# Altium project UU005_UUTurbidity.PrjPcb
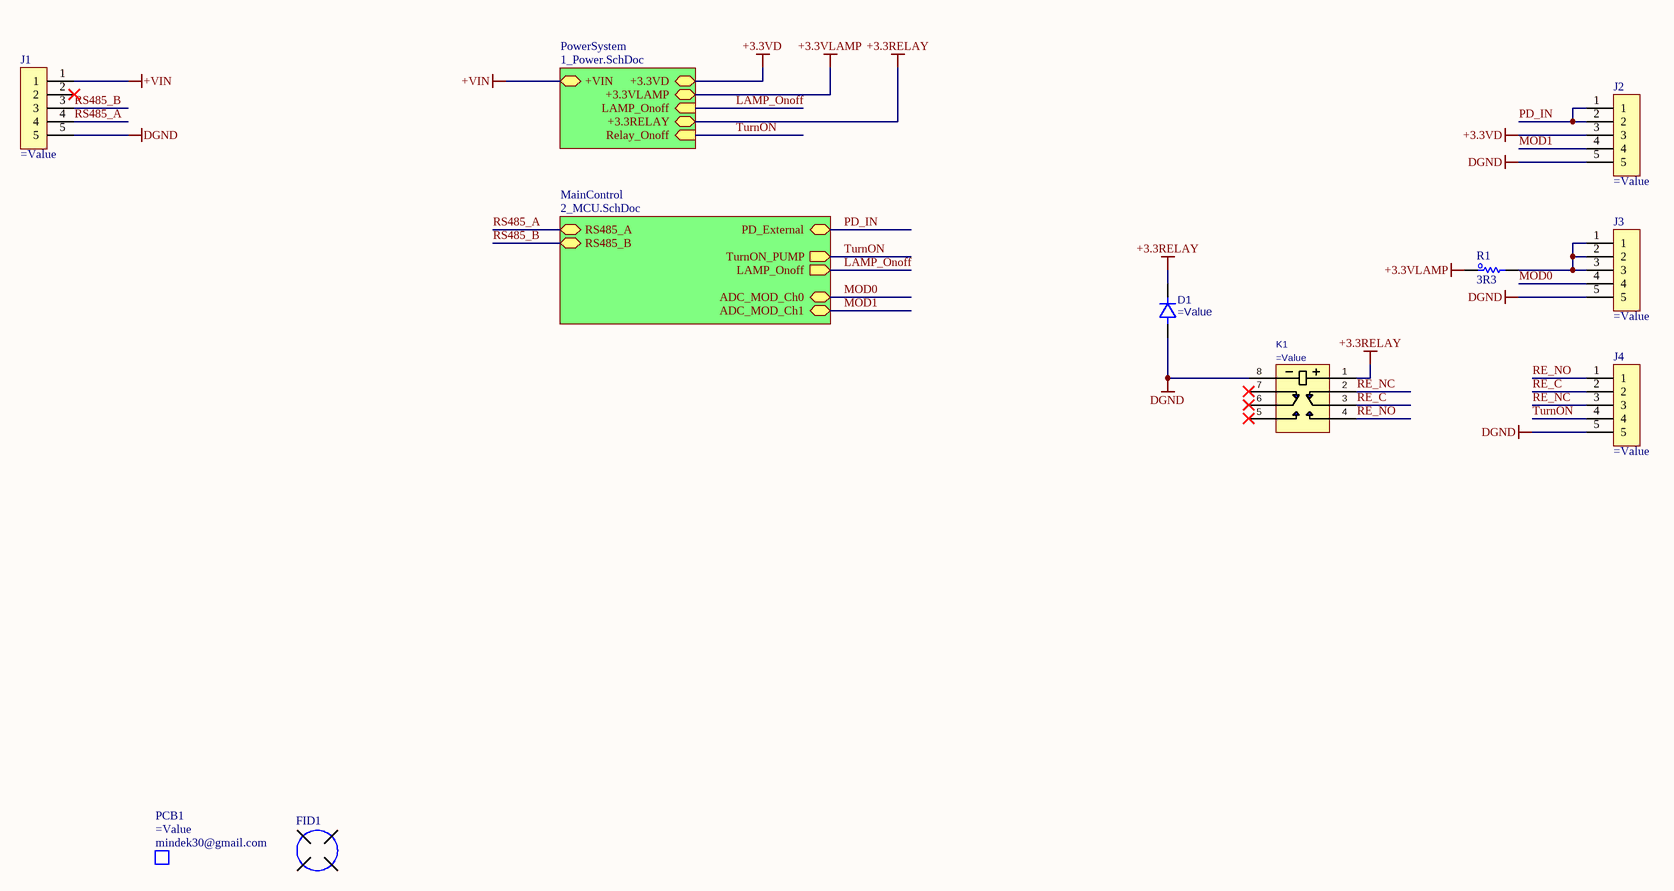
[diagram p0: 0_Overview.SchDoc]
PCB_Name: UU Turbidity; PCB_PN: UST001; PCB_Rev: A1; PCBA_PN: UST001; PCBA_Rev: A1
3 sheets, 70 parts. Net scope: hierarchical (ports join the sheet entries above them; power ports are global).
Board file: UST001_UUTurbidityControl.PcbDoc
Sheets:
  0_Overview.SchDoc
    MainControl = 2_MCU.SchDoc
    PowerSystem = 1_Power.SchDoc

## Sheet 0_Overview.SchDoc: Overview
size A3; DocumentNumber: 1; SheetNumber: 1; SheetTotal: 6; PageSetup: Record=PageOptions|CenterHorizontal=True|CenterVertical=True|PrintScale=1.01|XCorrection=1.00|YCorrection=1.00|PrintKind=0|BorderSize=5000000|LeftOffset=0|BottomOffset=0|Orientation=2|PaperLength=1000|PaperWidth=1000|Scale=100|PaperSource=7|PrintQuality=-4|MediaType=1|DitherType=10|PaperKind=A3|PrintScaleMode=1

### Parts
D1  (no value)  [SOD323]
FID1  FIDUCIAL  [FID]  (value not drawn)  (no BOM)
J1  (no value)  [MOLEX_532610571]
J2  (no value)  [MOLEX_532610571]
J3  (no value)  [MOLEX_532610571]
J4  (no value)  [MOLEX_532610571]
K1  (no value)  [RELAY_HFD4/12-SR]
PCB1  Manufacturer: mindek30@gmail.com  (mechanical)
R1  3R3  [R_2512]

### Sub-sheets
MainControl = 2_MCU.SchDoc: RS485_A (bidir), RS485_B (bidir), LAMP_Onoff (out), TurnON_PUMP (out), ADC_MOD_Ch0 (bidir), ADC_MOD_Ch1 (bidir), PD_External (bidir)
PowerSystem = 1_Power.SchDoc: +3.3VD (bidir), +VIN (bidir), +3.3VLAMP (bidir), LAMP_Onoff (in), Relay_Onoff (in), +3.3RELAY (bidir)

### Nets
+3.3RELAY: D1.1 K1.1 ; sheet PowerSystem/+3.3RELAY
+3.3VD: J2.3 ; sheet PowerSystem/+3.3VD
+3.3VLAMP: R1.1 ; sheet PowerSystem/+3.3VLAMP
+VIN: J1.1 ; sheet PowerSystem/+VIN
DGND: D1.2 J1.5 J2.5 J3.5 J4.5 K1.8
LAMP_Onoff: sheet MainControl/LAMP_Onoff, sheet PowerSystem/LAMP_Onoff
MOD0: J3.4 ; sheet MainControl/ADC_MOD_Ch0  [project net ADC_MOD_Ch0]
MOD1: J2.4 ; sheet MainControl/ADC_MOD_Ch1  [project net ADC_MOD_Ch1]
PD_IN: J2.1 J2.2 ; sheet MainControl/PD_External  [project net ADC_Ch0]
RE_C: J4.2 K1.3
RE_NC: J4.3 K1.2
RE_NO: J4.1 K1.4
RS485_A: J1.4 ; sheet MainControl/RS485_A
RS485_B: J1.3 ; sheet MainControl/RS485_B
TurnON: J4.4 ; sheet MainControl/TurnON_PUMP, sheet PowerSystem/Relay_Onoff
NetJ3_1: J3.1 J3.2 J3.3 R1.2

Not connected (* = marked no-connect by the designer): J1 2*; K1 5* 6* 7*

### Notes on the sheet
- Title :
- Revision :
- ผู้จัดทำ:
- Size:
- A3
- Time:
- ผู้เขียน:
- บริษัท ยูนิเวอร์แซล ยูทีลิตี้ส์ จำกัด (มหาชน) เลขที่ 1 อาคาร อีสท์วอเตอร์ ชั้น 18 ซอยวิภาวดีรังสิต 5 แขวงจอมพล เขตจตุจักร กรุงเทพฯ 10900
  Tel : +662-272-1688
  Fax :+662-2721690-1
- -
- Sheet:
- of
- ผู้อำนวยการ
- ผู้ตรวจสอบ:
- Number:
- กรรมการผู้จัดการ:
- File:

### Library data of the parts
D1 = D_PW_SD103AWS: DIODE SCHOTTKY 40V 2A 0603; Manufacturer: Slkor(SLKORMICRO Elec.); Value: SD103AWS; PackageReference: SOD-323; PartID: C513472; PartNumber: SD103AWS
FID1 = FID_FIDUCIAL: Manufacturer: mindek30@gmail.com; PartNumber: UST001_A1; Value2: Non SE; Value: Non SE; PartID: A1; PackageReference: Non SE; Value3: Non SE
J1-J4 = CON_5P_532610571: CONN HEADER SMD R/A 5POS 1.25MM; PartNumber: 0532610571; Manufacturer: Molex; Value: 0532610571; Value2: AFC12-S05DCC-00; PartID: WM7623CT-ND; PackageReference: 5P; Value3: *
K1 = SW_RELAY_HFD4/12-SR: Telecom Non Latching 3VDC DPDT SMD Relays RoHS; Manufacturer: Xiamen Hongfa Electroacoustic; Value: HFD4/3-S1R; PackageReference: *; PartID: C143232; PartNumber: HFD4/3-S1R
PCB1 = PCB_Bare: BARE PCB; PartNumber: UST001_A1; PackageReference: Non SE; PartID: A1; Value2: =JobFile_Title; Value: =PartNumber; Value3: UST001_A1
R1 = R_Resister: RES SMD 3.3 OHM 5% 3W 2512; Manufacturer: Vishay; PartNumber: 35223R3JT; Value: 3R3; PackageReference: 2512; PartID: A121247CT-ND; Value2: 3W; Value3: 5%

## Sheet 2_MCU.SchDoc
size A3; DocumentNumber: 3; SheetNumber: 3; SheetTotal: 6; PageSetup: Record=PageOptions|CenterHorizontal=True|CenterVertical=True|PrintScale=1.01|XCorrection=1.00|YCorrection=1.00|PrintKind=0|BorderSize=5000000|LeftOffset=0|BottomOffset=0|Orientation=2|PaperLength=1000|PaperWidth=1000|Scale=100|PaperSource=7|PrintQuality=-4|MediaType=1|DitherType=10|PaperKind=A3|PrintScaleMode=1
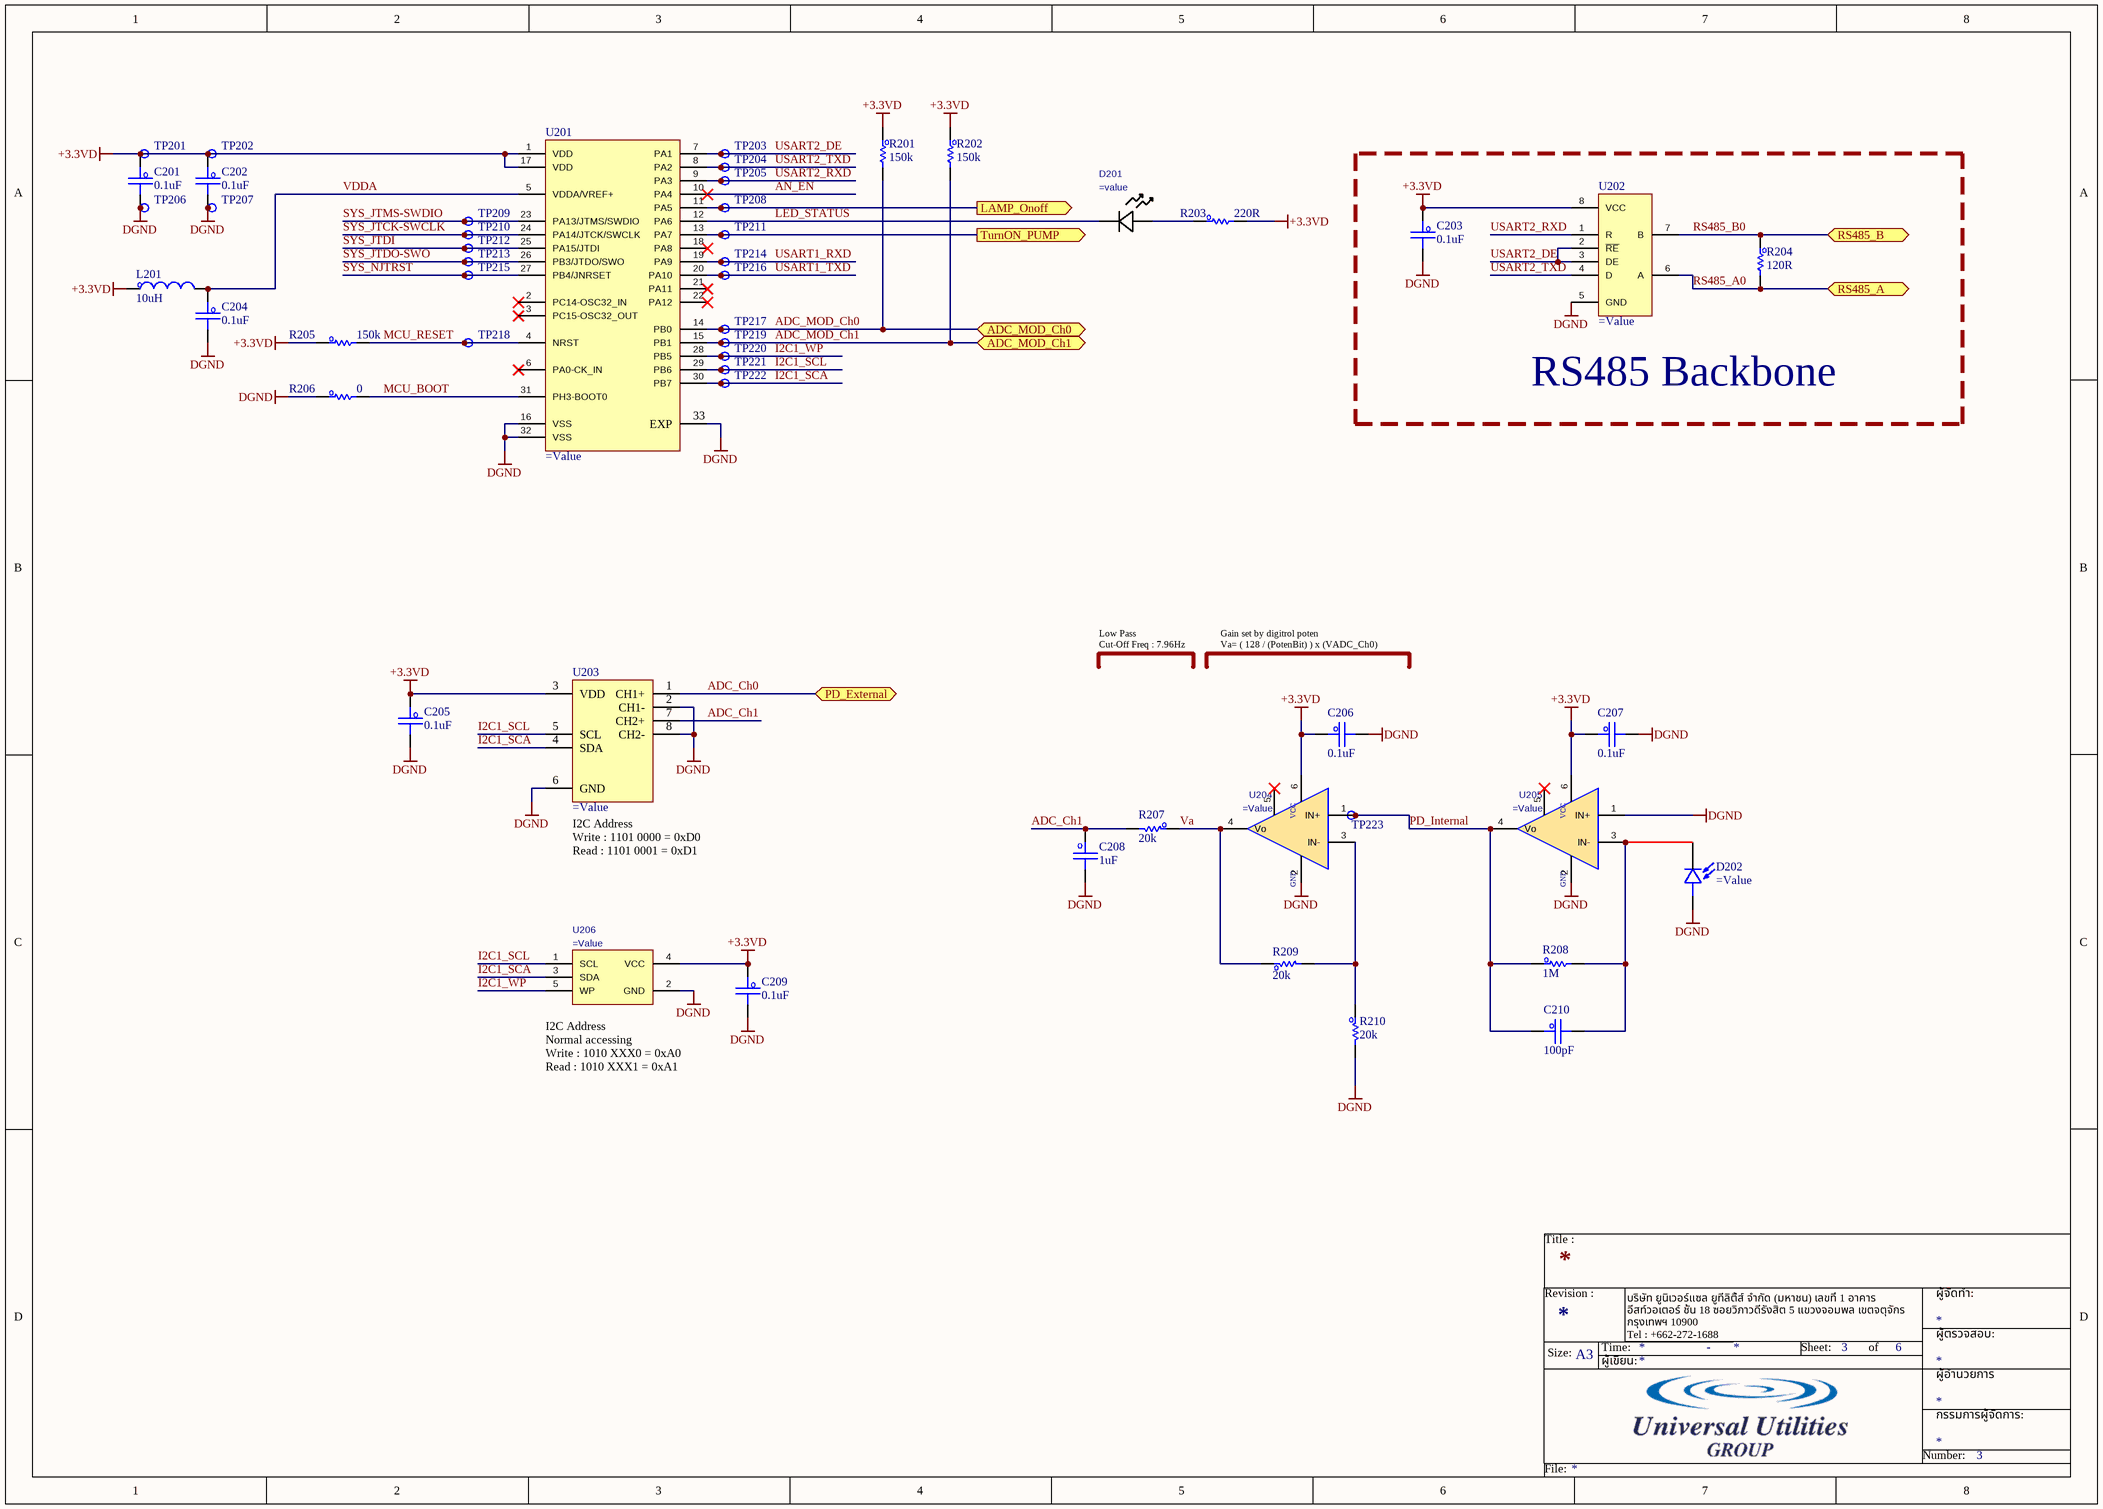
[diagram p1: 2_MCU.SchDoc]

### Parts
C201  0.1uF  [C_0603]
C202  0.1uF  [C_0603]
C203  0.1uF  [C_0603]
C204  0.1uF  [C_0603]
C205  0.1uF  [C_0603]
C206  0.1uF  [C_0603]
C207  0.1uF  [C_0603]
C208  1uF  [C_0603]
C209  0.1uF  [C_0603]
C210  100pF  [C_0603]
D201  (no value)  [LED_0VS75000_WRE]
D202  (no value)  [TO254P950H570-2]
L201  10uH  [L_0402]
R201  150k  [R_0603]
R202  150k  [R_0603]
R203  220R  [R_0603]
R204  120R  [R_0603]
R205  150k  [R_0603]
R206  0  [R_0603]
R207  20k  [R_0603]
R208  1M  [R_0603]
R209  20k  [R_0603]
R210  20k  [R_0603]
TP201  (no value)  [TP_Testpoint]  (no BOM)
TP202  (no value)  [TP_Testpoint]  (no BOM)
TP203  (no value)  [TP_Testpoint]  (no BOM)
TP204  (no value)  [TP_Testpoint]  (no BOM)
TP205  (no value)  [TP_Testpoint]  (no BOM)
TP206  (no value)  [TP_Testpoint]  (no BOM)
TP207  (no value)  [TP_Testpoint]  (no BOM)
TP208  (no value)  [TP_Testpoint]  (no BOM)
TP209  (no value)  [TP_Testpoint]  (no BOM)
TP210  (no value)  [TP_Testpoint]  (no BOM)
TP211  (no value)  [TP_Testpoint]  (no BOM)
TP212  (no value)  [TP_Testpoint]  (no BOM)
TP213  (no value)  [TP_Testpoint]  (no BOM)
TP214  (no value)  [TP_Testpoint]  (no BOM)
TP215  (no value)  [TP_Testpoint]  (no BOM)
TP216  (no value)  [TP_Testpoint]  (no BOM)
TP217  (no value)  [TP_Testpoint]  (no BOM)
TP218  (no value)  [TP_Testpoint]  (no BOM)
TP219  (no value)  [TP_Testpoint]  (no BOM)
TP220  (no value)  [TP_Testpoint]  (no BOM)
TP221  (no value)  [TP_Testpoint]  (no BOM)
TP222  (no value)  [TP_Testpoint]  (no BOM)
TP223  (no value)  [TP_Testpoint]  (no BOM)
U201  (no value)  [QFN50P500X500X60-33N]
U202  (no value)  [SOP65P490X110-8N]
U203  (no value)  [SON50P200X300X100-9N]
U204  (no value)  [SOT65P210X110-6N]
U205  (no value)  [SOT65P210X110-6N]
U206  (no value)  [SOT65P210X110-5N]

### Blocks framed on the sheet
RS485 Backbone: C203 R204 U202

### Ports
ADC_MOD_Ch0 (bidir), ADC_MOD_Ch1 (bidir), LAMP_Onoff (out), PD_External (bidir), RS485_A (bidir), RS485_B (bidir), TurnON_PUMP (out)

### Nets
+3.3VD: C201.1 C202.1 C203.1 C205.1 C206.1 C207.1 C209.1 L201.1 R201.1 R202.1 R203.2 R205.1 TP201.1 TP202.1 U201.1(VDD) U201.17(VDD) U202.8(VCC) U203.3(VDD) U204.6(VDD) U205.6(VDD) U206.4(VCC)
DGND: C201.2 C202.2 C203.2 C204.2 C205.2 C206.2 C207.2 C208.2 C209.2 D202.A R206.1 R210.2 TP206.1 TP207.1 U201.16(VSS) U201.32(VSS) U201.33(EXP) U202.5(GND) U203.2(CH1-) U203.6(GND) U203.8(CH2-) U204.2(GND) U205.1(IN+) U205.2(GND) U206.2(GND)
ADC_Ch0: U203.1(CH1+) ; port PD_External
ADC_Ch1: C208.1 R207.2 U203.7(CH2+)
ADC_MOD_Ch0: R201.2 TP217.1 U201.14(PB0) ; port ADC_MOD_Ch0
ADC_MOD_Ch1: R202.2 TP219.1 U201.15(PB1) ; port ADC_MOD_Ch1
AN_EN: U201.10(PA4)
I2C1_SCA: TP222.1 U201.30(PB7) U203.4(SDA) U206.3(SDA)
I2C1_SCL: TP221.1 U201.29(PB6) U203.5(SCL) U206.1(SCL)
I2C1_WP: TP220.1 U201.28(PB5) U206.5(WP)
LAMP_Onoff: TP208.1 U201.11(PA5) ; port LAMP_Onoff
LED_STATUS: D201.2 U201.12(PA6)
MCU_BOOT: R206.2 U201.31(PH3-BOOT0)
MCU_RESET: R205.2 TP218.1 U201.4(NRST)
PD_Internal: C210.1 R208.1 TP223.1 U204.1(IN+) U205.4(Vo)
RS485_A0: R204.2 U202.6(A) ; port RS485_A  [project net RS485_A]
RS485_B0: R204.1 U202.7(B) ; port RS485_B  [project net RS485_B]
SYS_JTCK-SWCLK: TP210.1 U201.24(PA14/JTCK/SWCLK)
SYS_JTDI: TP212.1 U201.25(PA15/JTDI)
SYS_JTDO-SWO: TP213.1 U201.26(PB3/JTDO/SWO)
SYS_JTMS-SWDIO: TP209.1 U201.23(PA13/JTMS/SWDIO)
SYS_NJTRST: TP215.1 U201.27(PB4/JNRSET)
TurnON: TP211.1 U201.13(PA7) ; port TurnON_PUMP
USART1_RXD: TP214.1 U201.19(PA9)
USART1_TXD: TP216.1 U201.20(PA10)
USART2_DE: TP203.1 U201.7(PA1) U202.2(~{RE}) U202.3(DE)
USART2_RXD: TP205.1 U201.9(PA3) U202.1(R)
USART2_TXD: TP204.1 U201.8(PA2) U202.4(D)
Va: R207.1 R209.1 U204.4(Vo)
VDDA: C204.1 L201.2 U201.5(VDDA/VREF+)
NetC210_2: C210.2 D202.C R208.2 U205.3(IN-)
NetD201_1: D201.1 R203.1
NetR209_2: R209.2 R210.1 U204.3(IN-)

Not connected (* = marked no-connect by the designer): U201 2(PC14-OSC32_IN)* 3(PC15-OSC32_OUT)* 6(PA0-CK_IN)* 18(PA8)* 21(PA11)* 22(PA12)*; U204 5(Vo)*; U205 5(Vo)*

### Notes on the sheet
- Low Pass
  Cut-Off Freq : 7.96Hz
- Gain set by digitrol poten
  Va= ( 128 / (PotenBit) ) x (VADC_Ch0)
- (near U203) I2C Address
  Write : 1101 0000 = 0xD0
  Read : 1101 0001 = 0xD1
- (near U206) I2C Address
  Normal accessing
  Write : 1010 XXX0 = 0xA0
  Read : 1010 XXX1 = 0xA1
- Title :
- Revision :
- ผู้จัดทำ:
- Size:
- A3
- Time:
- ผู้เขียน:
- บริษัท ยูนิเวอร์แซล ยูทีลิตี้ส์ จำกัด (มหาชน) เลขที่ 1 อาคาร อีสท์วอเตอร์ ชั้น 18 ซอยวิภาวดีรังสิต 5 แขวงจอมพล เขตจตุจักร กรุงเทพฯ 10900
  Tel : +662-272-1688
  Fax :+662-2721690-1
- -
- Sheet:
- of
- ผู้อำนวยการ
- ผู้ตรวจสอบ:
- Number:
- กรรมการผู้จัดการ:
- File:
- (in symbol IC_OPAMP_OPA607) VCC

### Library data of the parts
C201-C207 C209 = C_Capacitor: CAP CER 0.1UF 50V X7R 0603; Manufacturer: KEMET; PartNumber: C0603C104K5RACTU; PackageReference: 0603; PartID: 399-5089-1-ND; Value2: 50V; Value: 0.1uF; Value3: *
C208 = C_Capacitor: CAP CER 0603 1UF 6.3V X7R 5%; Manufacturer: KEMET; PartNumber: C0603X105J9RAC7867; PackageReference: 0603; PartID: 399-17700-1-ND; Value2: 6.3V; Value: 1uF; Value3: X7R
C210 = C_Capacitor: CAP CER 100PF 100V X7R 0603; Manufacturer: AVX Corporation; PartNumber: 06031C101JAT2A; Value3: ±5%; PackageReference: 0603; PartID: 478-12671-1-ND; Value2: 100V; Value: 100pF
D201 = D_LED_150060BS75000: LED BLUE CLEAR 0603 SMD; Manufacturer: Wurth Electronics; Value: 150060VS75000; PackageReference: 0603; PartID: 732-4980-1-ND; PartNumber: 150060VS75000
D202 = D_PD_BPX61: SENSOR PHOTODIODE 850NM TO39-2; PartNumber: BPX 61; Manufacturer: OSRAM Opto Semiconductors Inc.; Value: BPX 61; PartID: 475-1350-ND; PackageReference: *; Value3: *
L201 = L_Inductor: 10µH Shielded Multilayer Inductor 250mA 1.05Ohm 0603 (1608 Metric); Manufacturer: TDK Corporation; PartNumber: MLZ1608M100WT000; Value: 10uH; PackageReference: 0603; PartID: 445-6389-1-ND; Value3: *
R201 R202 R205 = R_Resister: RES SMD 150K OHM 1% 1/10W 0603; Manufacturer: Vishay Dale; PartNumber: CRCW0603150KFKEAC; Value2: 0.1W; Value: 150k; PackageReference: 0603; PartID: 541-4034-1-ND; Value3: *
R203 = R_Resister: RES SMD 220 OHM 1% 1/10W 0603; Manufacturer: Vishay Dale; PartNumber: CRCW0603220RFKEAC; Value2: 0.1W; Value: 220R; PackageReference: 0603; PartID: 541-4047-1-ND; Value3: *
R204 = R_Resister: RES SMD 120 OHM 1% 1/3W 0603; Manufacturer: Vishay Dale; PartNumber: CRCW0603120RFKEAHP; Value2: 0.333W; Value: 120R; PackageReference: 0603; PartID: 541-120SCT-ND; Value3: *
R206 = R_Resister: RES SMD 0 OHM JUMP 1/10W 0603; Manufacturer: Vishay Dale; PartNumber: CRCW06030000Z0EBC; Value2: 0.1W; Value: 0; PackageReference: 0603; PartID: 541-4013-1-ND; Value3: *
R207 R209 R210 = R_Resister: RES SMD 20K OHM 5% 1/4W 0603; Manufacturer: Panasonic Electronic Components; PartNumber: ERJ-PA3J203V; Value2: 0.1W; Value: 20k; PackageReference: 0603; PartID: P20KBZCT-ND; Value3: *
R208 = R_Resister: RES SMD 1M OHM 5% 1/10W 0603; Manufacturer: YAGEO; PartNumber: AC0603JR-071ML; Value2: 0.1W; Value: 1M; PackageReference: 0603; PartID: 311-1MLECT-ND; Value3: 5%
TP201-TP223 = TP_TestPoint: TestPoint; Manufacturer: *; PackageReference: *; PartID: *; PartNumber: *; Value2: *; Value3: *
U201 = IC_MCU_STM32L432: IC MCU 32BIT 256KB FLSH 32UFQFPN; PartNumber: STM32L432KCU6; Manufacturer: STMicroelectronics; Value: STM32L432KCU6; PartID: 497-16578-ND; PackageReference: *; Value2: *; Value3: *
U202 = IC_TRAN_SN65HVD78DGK: IC TRANSCEIVER FULL 1/1 8VSSOP; PartNumber: SN65HVD77DGKR; Manufacturer: Texas Instruments; Value: SN65HVD77DGKR; PartID: 296-40528-1-ND; PackageReference: VSSOP-8; Value2: *; Value3: *
U203 = IC_ADC_MCP3422A0: IC ADC 18BIT SIGMA-DELTA 8DFN; PartNumber: MCP3422A0-E/MC; Manufacturer: Microchip Technology; Value: MCP3422A0-E/MC; PartID: MCP3422A0-E/MC-ND; PackageReference: DFN-8; Value2: *; Value3: *
U204 U205 = IC_OPAMP_OPA607: LOW POWER, PRECISION, 50 MHZ DEC; Manufacturer: Texas Instruments; Value: OPA607IDCKR; PackageReference: SC-70-6; PartID: 296-OPA607IDCKRCT-ND; PartNumber: OPA607IDCKR
U206 = IC_MEM_24AA02HT: IC EEPROM 2KBIT I2C SC70-5; Manufacturer: Microchip Technology; Value: 24AA02HT-I/LT; PackageReference: SC-70-5; PartID: 24AA02HT-I/LTCT-ND; PartNumber: 24AA02HT-I/LT

## Sheet 1_Power.SchDoc
size A3; DocumentNumber: 2; SheetNumber: 2; SheetTotal: 6
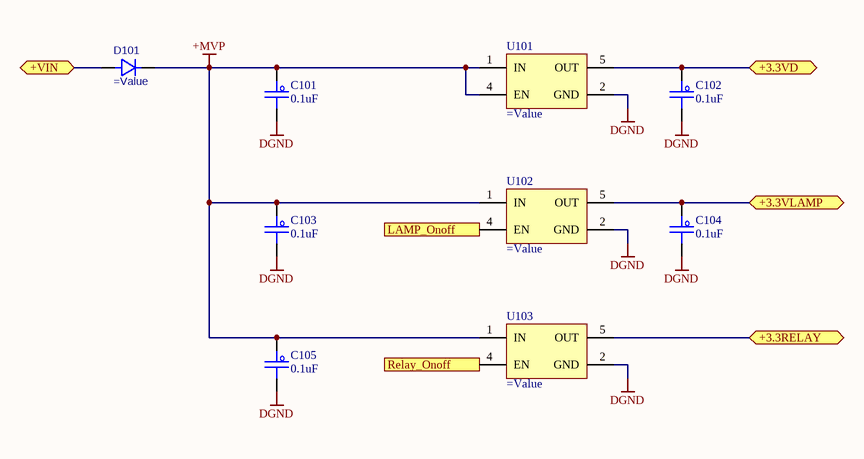
[diagram p2: 1_Power.SchDoc]

### Parts
C101  0.1uF  [C_0603]
C102  0.1uF  [C_0603]
C103  0.1uF  [C_0603]
C104  0.1uF  [C_0603]
C105  0.1uF  [C_0603]
D101  (no value)  [SOD323]
U101  (no value)  [SOT95P280X145-5N]
U102  (no value)  [SOT95P280X145-5N]
U103  (no value)  [SOT95P280X145-5N]

### Ports
+3.3RELAY (bidir), +3.3VD (bidir), +3.3VLAMP (bidir), +VIN (bidir), LAMP_Onoff (in), Relay_Onoff (in)

### Nets
+3.3RELAY: U103.5(OUT) ; port +3.3RELAY
+3.3VD: C102.1 U101.5(OUT) ; port +3.3VD
+3.3VLAMP: C104.1 U102.5(OUT) ; port +3.3VLAMP
+MVP: C101.1 C103.1 C105.1 D101.1 U101.1(IN) U101.4(EN) U102.1(IN) U103.1(IN)
+VIN: D101.2 ; port +VIN
DGND: C101.2 C102.2 C103.2 C104.2 C105.2 U101.2(GND) U102.2(GND) U103.2(GND)
LAMP_Onoff: U102.4(EN) ; port LAMP_Onoff
TurnON: U103.4(EN) ; port Relay_Onoff

### Notes on the sheet
- Title :
- Revision :
- ผู้จัดทำ:
- Size:
- A3
- Time:
- ผู้เขียน:
- บริษัท ยูนิเวอร์แซล ยูทีลิตี้ส์ จำกัด (มหาชน) เลขที่ 1 อาคาร อีสท์วอเตอร์ ชั้น 18 ซอยวิภาวดีรังสิต 5 แขวงจอมพล เขตจตุจักร กรุงเทพฯ 10900
  Tel : +662-272-1688
  Fax :+662-2721690-1
- -
- Sheet:
- of
- ผู้อำนวยการ
- ผู้ตรวจสอบ:
- Number:
- กรรมการผู้จัดการ:
- File:

### Library data of the parts
C101-C105 = C_Capacitor: as C201 on sheet 2_MCU; PackageReference: 0603; PartID: 399-5089-1-ND; Value2: 50V; Value: 0.1uF; Value3: *
D101 = D_PW_SD103AWS: as D1 on sheet 0_Overview; Value: SD103AWS; PackageReference: SOD-323; PartID: C513472; PartNumber: SD103AWS
U101-U103 = IC_LDO_RT9069-33GB: 200mA 360mV@(10mA) Fixed 3.3V~3.3V Positive 1 36V SOT-23-5 Linear Voltage Regulators (LDO) ROHS; Manufacturer: Richtek Tech; PartNumber: RT9069-33GB; PartID: C147969; PackageReference: SOT-23-5; Value: RT9069-33GB; Value2: *; Value3: *

## Nets that join several sheets
+3.3RELAY: 0_Overview (D1.1 K1.1), 1_Power (U103.5)
+3.3VD: 0_Overview (J2.3), 2_MCU (21 pins), 1_Power (C102.1 U101.5)
+3.3VLAMP: 0_Overview (R1.1), 1_Power (C104.1 U102.5)
+VIN: 0_Overview (J1.1), 1_Power (D101.2)
DGND: 0_Overview (6 pins), 2_MCU (25 pins), 1_Power (8 pins)
ADC_Ch0: 0_Overview (J2.1 J2.2), 2_MCU (U203.1)
ADC_MOD_Ch0: 0_Overview (J3.4), 2_MCU (R201.2 TP217.1 U201.14)
ADC_MOD_Ch1: 0_Overview (J2.4), 2_MCU (R202.2 TP219.1 U201.15)
LAMP_Onoff: 2_MCU (TP208.1 U201.11), 1_Power (U102.4)
RS485_A: 0_Overview (J1.4), 2_MCU (R204.2 U202.6)
RS485_B: 0_Overview (J1.3), 2_MCU (R204.1 U202.7)
TurnON: 0_Overview (J4.4), 2_MCU (TP211.1 U201.13), 1_Power (U103.4)